# EAGLE design CTRL (EAGLE 7.6.0)
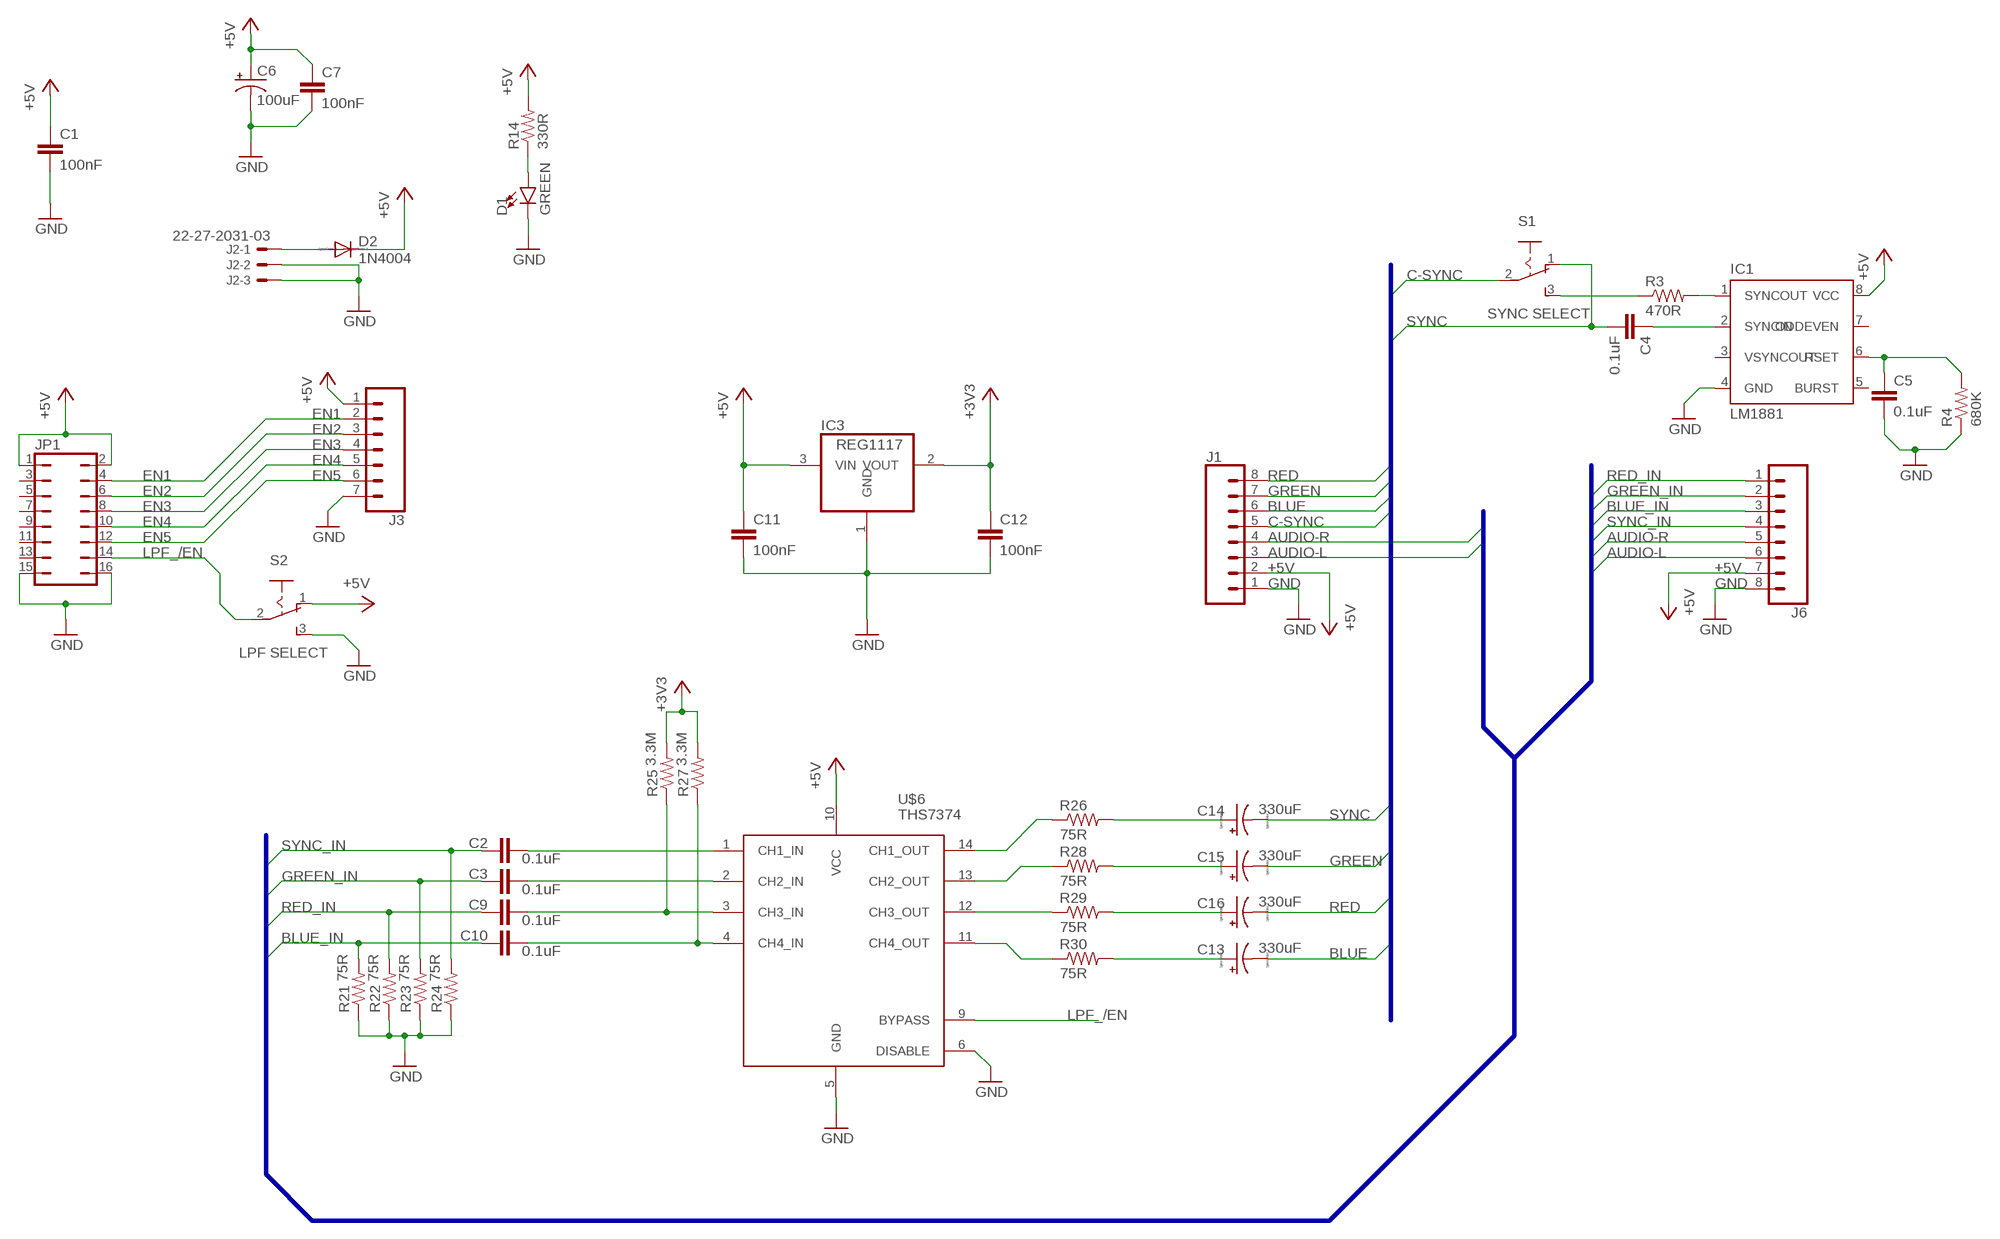
[diagram p0: schematic, sheet 1]

## Parts
C1  100nF  C-EU075-032X103  [C075-032X103]
C2  0.1uF  C-EU050-025X075  [C050-025X075]
C3  0.1uF  C-EU050-025X075  [C050-025X075]
C4  0.1uF  C7.5/3  [C7.5B3]
C5  0.1uF  C7.5/3  [C7.5B3]
C6  100uF  CPOL-USE2.5-7  [E2,5-7]
C7  100nF  C-EU075-032X103  [C075-032X103]
C9  0.1uF  C-EU050-025X075  [C050-025X075]
C10  0.1uF  C-EU050-025X075  [C050-025X075]
C11  100nF  C-EU075-032X103  [C075-032X103]
C12  100nF  C-EU075-032X103  [C075-032X103]
C13  330uF  CPOL-USD/7343-31W  [D/7343-31W]
C14  330uF  CPOL-USD/7343-31W  [D/7343-31W]
C15  330uF  CPOL-USD/7343-31W  [D/7343-31W]
C16  330uF  CPOL-USD/7343-31W  [D/7343-31W]
D1  GREEN  LED5MM  [LED_5MM]
D2  1N4004  [DO41-10]
IC1  LM1881  [DIL08]
IC3  REG1117  [SOT223]
J1  CONN_08LONGPADS  [1X08_LONGPADS]
J2  22-27-2031-03  [6410-03]
J3  CONN_07LONGPADS  [1X07_LONGPADS]
J6  CONN_08LONGPADS  [1X08_LONGPADS]
JP1  JP8Q  [JP8Q]
R3  470R  R-US_0204/7  [0204/7]
R4  680K  R-US_0204/7  [0204/7]
R14  330R  R-US_0204/7  [0204/7]
R21  75R  R-US_0204/2V  [0204V]
R22  75R  R-US_0204/2V  [0204V]
R23  75R  R-US_0204/2V  [0204V]
R24  75R  R-US_0204/2V  [0204V]
R25  3.3M  R-US_0204/7  [0204/7]
R26  75R  R-US_0204/7  [0204/7]
R27  3.3M  R-US_0204/7  [0204/7]
R28  75R  R-US_0204/7  [0204/7]
R29  75R  R-US_0204/7  [0204/7]
R30  75R  R-US_0204/7  [0204/7]
S1  SYNC SELECT  255SB  [255SB]
S2  LPF SELECT  255SB  [255SB]
U$6  THS7374  [TSSOP-14]

## Nets
+3V3: C12.1 IC3.2(VOUT) R25.2 R27.2
+5V: C1.1 C6.+ C7.1 C11.1 D2.C IC1.8(VCC) IC3.3(VIN) J1.2 J3.1 J6.7 JP1.1 JP1.2 R14.2 S2.1(O) U$6.10(VCC)
AUDIO-L: J1.3 J6.6
AUDIO-R: J1.4 J6.5
BLUE: C13.- J1.6
BLUE_IN: C10.1 J6.3 R21.2
C-SYNC [AMP]: J1.5 S1.2(P)
EN1: J3.2 JP1.4
EN2: J3.3 JP1.6
EN3: J3.4 JP1.8
EN4: J3.5 JP1.10
EN5: J3.6 JP1.12
GND: C1.2 C5.2 C6.- C7.2 C11.2 C12.2 D1.K(C) IC1.4(GND) IC3.1(GND) J1.1 J2.2 J2.3 J3.7 J6.8 JP1.15 JP1.16 R4.1 R21.1 R22.1 R23.1 R24.1 S2.3(S) U$6.5(GND) U$6.6(DISABLE)
GREEN: C15.- J1.7
GREEN_IN: C3.1 J6.2 R23.2
LPF_/EN: JP1.14 S2.2(P) U$6.9(BYPASS)
N$5 [AMP]: R3.1 S1.3(S)
N$6 [AMP]: IC1.1(SYNCOUT) R3.2
N$7 [AMP]: C4.1 IC1.2(SYNCIN)
N$8 [AMP]: C5.1 IC1.6(RSET) R4.2
N$16: D1.A R14.1
N$17: D2.A J2.1
N$18 [AMP]: C3.2 U$6.2(CH2_IN)
N$19 [AMP]: C9.2 R25.1 U$6.3(CH3_IN)
N$20 [AMP]: C10.2 R27.1 U$6.4(CH4_IN)
N$21 [AMP]: C2.2 U$6.1(CH1_IN)
N$22 [AMP]: R26.1 U$6.14(CH1_OUT)
N$23 [AMP]: R28.1 U$6.13(CH2_OUT)
N$24 [AMP]: R29.1 U$6.12(CH3_OUT)
N$25 [AMP]: R30.1 U$6.11(CH4_OUT)
N$26: C13.+ R30.2
N$27: C16.+ R29.2
N$28: C15.+ R28.2
N$29: C14.+ R26.2
RED: C16.- J1.8
RED_IN: C9.1 J6.1 R22.2
SYNC [AMP]: C4.2 C14.- S1.1(O)
SYNC_IN: C2.1 J6.4 R24.2
Unconnected: IC1.3(VSYNCOUT) IC1.5(BURST) IC1.7(ODDEVEN) JP1.3 JP1.5 JP1.7 JP1.9 JP1.11 JP1.13

## Buses
B$1
B$2

## Library data of the parts
C1-C3 C7 C9-C12 = rcl:C-EU: CAPACITOR, European symbol
C4 C5 = capacitor-wima:C: CAPACITOR naming: grid - package width
C6 = rcl:CPOL-US: POLARIZED CAPACITOR, American symbol
C13-C16 = resistor:CPOL-US: POLARIZED CAPACITOR, American symbol
D1 = SparkFun-LED:LED: LED (Generic) Standard schematic elements and footprints for 5mm, 3mm, 1206, and 0603 sized LEDs. Generic LEDs with no color specified.
D2 = diode:1N4004: DIODE general purpose rectifier, 1 A
IC1 = lm1881:LM1881
IC3 = burr-brown:REG1117: 800mA and 1A Low Dropout (LDO) Positive Regulator 1.8V, 2.5V, 2.85V, 3.3V, 5V, and Adj; MPN: REG1117; OC_FARNELL: 1097566; OC_NEWARK: 14P6981
J1 J6 = SparkFun-Connectors:CONN_08: Multi connection point. Often used as Generic Header-pin footprint for 0.1 inch spaced/style header connections On any of the 0.1 inch spaced packages, you can populate with these: Break Away Headers - Straight <https://www.sparkfun.com/products/116> (PRT-00116) Break Away Male Headers - Right Angle <https://www.sparkfun.com/products/553> (PRT-00553) Female Headers <https://www.sparkfun.com/products/115> (PRT-00115) Break Away Headers - Machine Pin <https://www.sparkfun.com/products/117> (PRT-00117) Break Away Female Headers - Swiss Machine Pin <https://www.sparkfun.com/products/743> (PRT-00743) Arduino Stackable Header - 8 Pin <https://www.sparkfun.com/products/9279> (PRT-09279) For SCREWTERMINALS and SPRING TERMINALS visit here: Screw Terimnals on SparkFun.com <https://www.sparkfun.com/search/results?term=Screw+Terminals> (5mm/3.5mm/2.54mm spacing) This device is also useful as a general connection point to wire up your design to another part of your project. Our various solder wires solder well into these plated through hole pads. Hook-Up Wire - Assortment (Stranded, 22 AWG) <https://www.sparkfun.com/products/11375> (PRT-11375) Hook-Up Wire - Assortment (Solid Core, 22 AWG) <https://www.sparkfun.com/products/11367> (PRT-11367) View the entire wire category on our website here <https://www.sparkfun.com/categories/141> Special notes: Molex polarized connector foot print use with SKU : PRT-08231 with associated crimp pins and housings. 1MM SMD Version SKU: PRT-10208 NOTES ON THE VARIANTS LOCK and LOCK_LONGPADS... This footprint was designed to help hold the alignment of a through-hole component (i.e. 6-pin header) while soldering it into place. You may notice that each hole has been shifted either up or down by 0.005 of an inch from it's more standard position (which is a perfectly straight line). This slight alteration caused the pins (the squares in the middle) to touch the edges of the holes. Because they are alternating, it causes a "brace" to hold the component in place. 0.005 has proven to be the perfect amount of "off-center" position when using our standard breakaway headers. Although looks a little odd when you look at the bare footprint, once you have a header in there, the alteration is very hard to notice. Also,if you push a header all the way into place, it is covered up entirely on the bottom side.
J2 = con-molex:22-?-03: CONNECTOR wire to board 2.54 mm (.1 inch) pitch header; OC_FARNELL: unknown; OC_NEWARK: unknown
J3 = SparkFun-Connectors:CONN_07: Multi connection point. Often used as Generic Header-pin footprint for 0.1 inch spaced/style header connections On any of the 0.1 inch spaced packages, you can populate with these: Break Away Headers - Straight <https://www.sparkfun.com/products/116> (PRT-00116) Break Away Male Headers - Right Angle <https://www.sparkfun.com/products/553> (PRT-00553) Female Headers <https://www.sparkfun.com/products/115> (PRT-00115) Break Away Headers - Machine Pin <https://www.sparkfun.com/products/117> (PRT-00117) Break Away Female Headers - Swiss Machine Pin <https://www.sparkfun.com/products/743> (PRT-00743) For SCREWTERMINALS and SPRING TERMINALS visit here: Screw Terimnals on SparkFun.com <https://www.sparkfun.com/search/results?term=Screw+Terminals> (5mm/3.5mm/2.54mm spacing) This device is also useful as a general connection point to wire up your design to another part of your project. Our various solder wires solder well into these plated through hole pads. Hook-Up Wire - Assortment (Stranded, 22 AWG) <https://www.sparkfun.com/products/11375> (PRT-11375) Hook-Up Wire - Assortment (Solid Core, 22 AWG) <https://www.sparkfun.com/products/11367> (PRT-11367) View the entire wire category on our website here <https://www.sparkfun.com/categories/141> Special notes: Molex polarized connector foot print use with SKU : PRT-08231 with associated crimp pins and housings. 1MM SMD Version SKU: PRT-10208 NOTES ON THE VARIANTS LOCK and LOCK_LONGPADS... This footprint was designed to help hold the alignment of a through-hole component (i.e. 6-pin header) while soldering it into place. You may notice that each hole has been shifted either up or down by 0.005 of an inch from it's more standard position (which is a perfectly straight line). This slight alteration caused the pins (the squares in the middle) to touch the edges of the holes. Because they are alternating, it causes a "brace" to hold the component in place. 0.005 has proven to be the perfect amount of "off-center" position when using our standard breakaway headers. Although looks a little odd when you look at the bare footprint, once you have a header in there, the alteration is very hard to notice. Also,if you push a header all the way into place, it is covered up entirely on the bottom side.
JP1 = jumper:JP8Q: JUMPER
R3 R4 R21-R30 = rcl:R-US_: RESISTOR, American symbol
R14 = resistor:R-US_: RESISTOR, American symbol
S1 S2 = switch:255SB: SLIDING SWITCH Distributor Buerklin, 11G810
U$6 = THS7374:THS7374

## Net classes
0 default: width 0.406 mm
1 AMP: width 0.381 mm

## Board
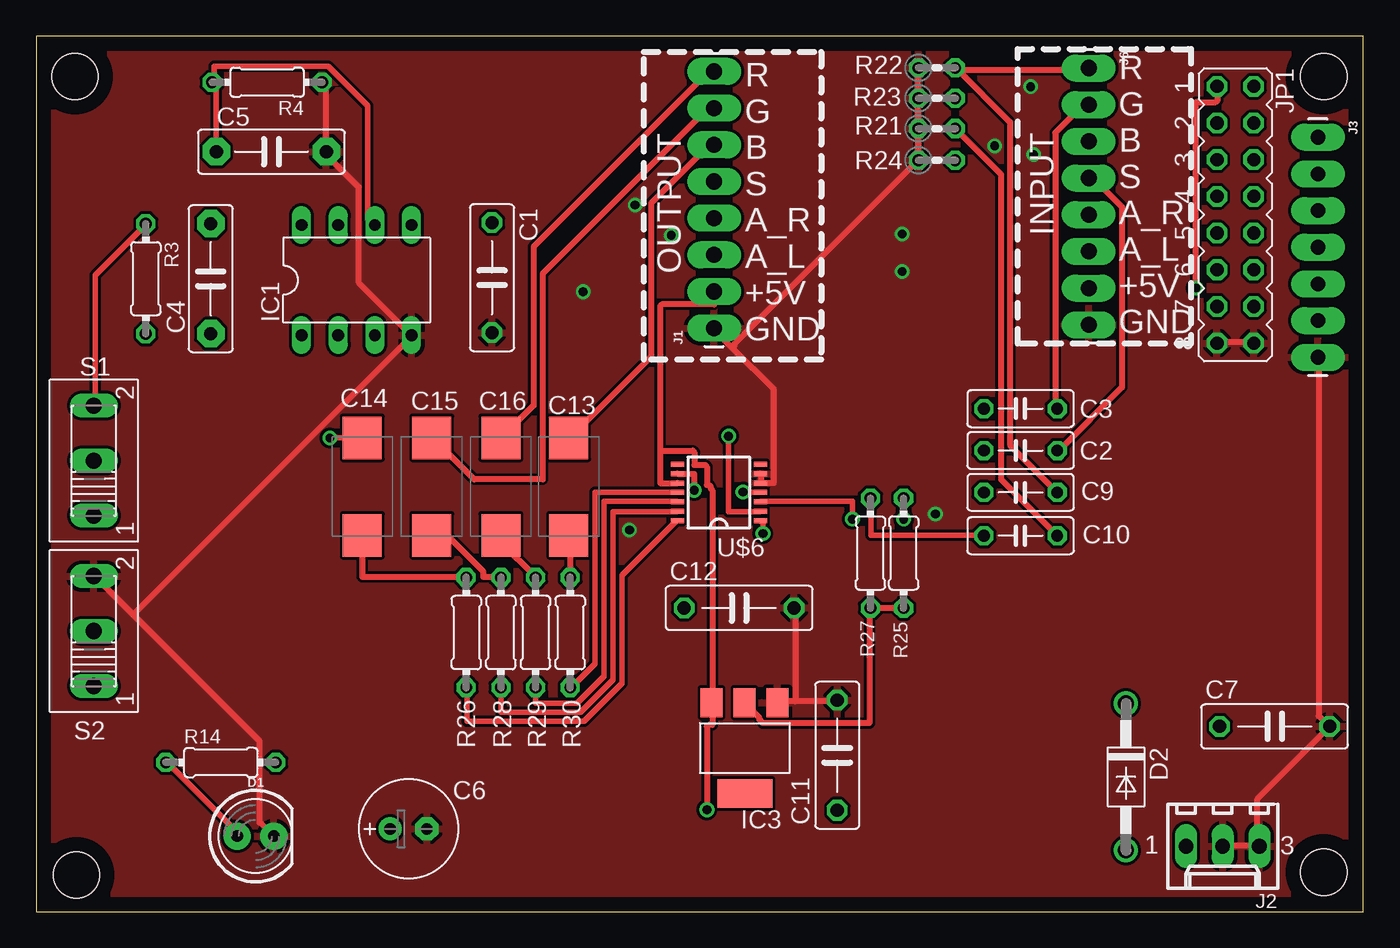
[diagram p1: board, top side]
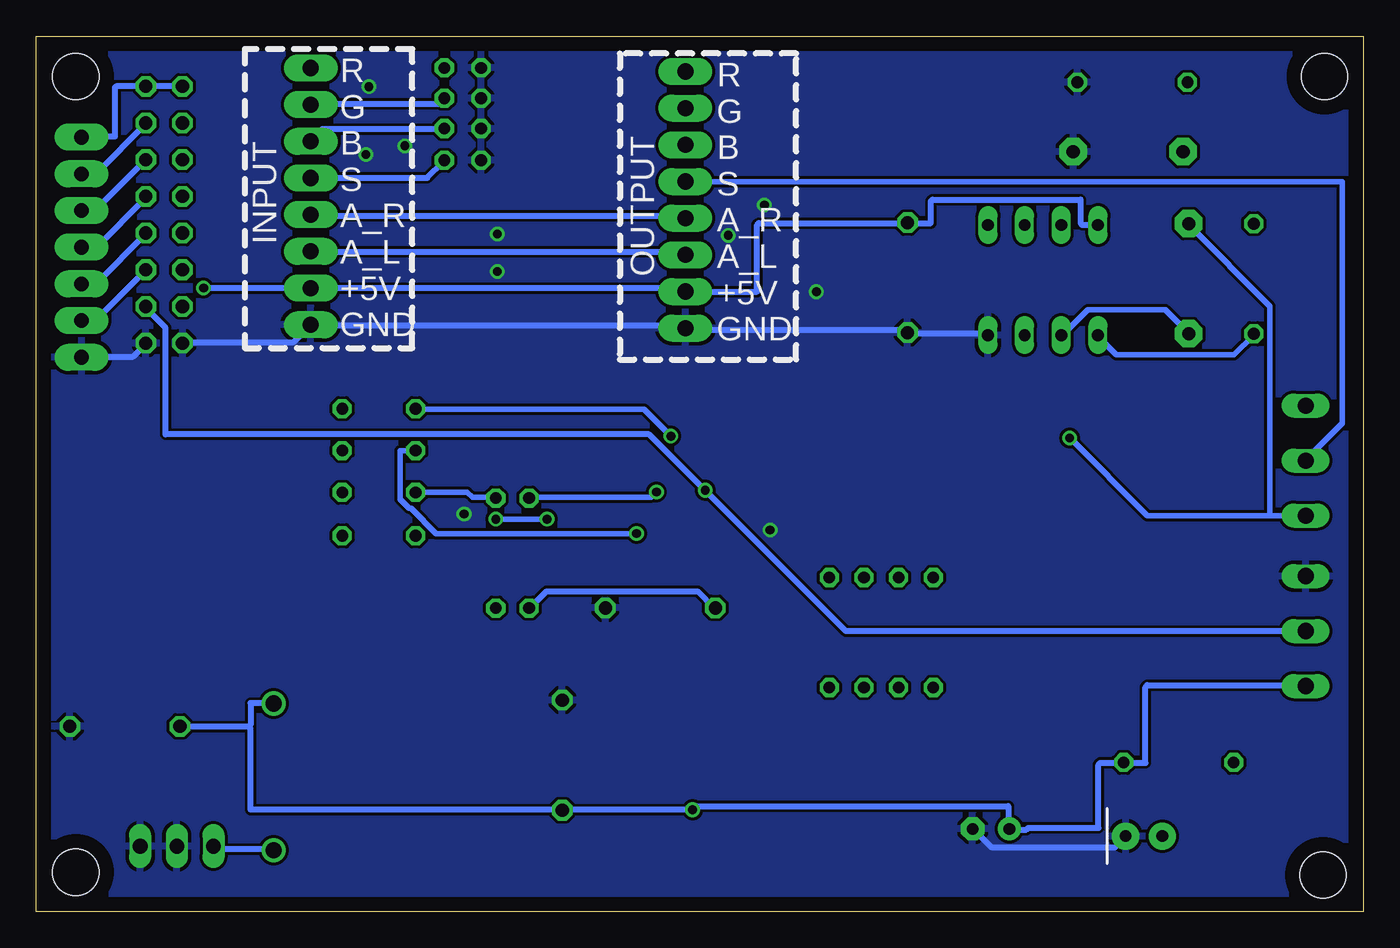
[diagram p2: board, bottom side, seen from below]

Size 91.95 x 60.63 mm. Coordinates in mm from the lower left corner, seen from the top.
Outline: 0,0 91.95,0 91.95,60.63 0,60.63 0,0
Copper layers (1*16): Top 0.035mm / dielectric 1.5mm / Bottom 0.035mm
Design rules "default": minimum track width 10mil, minimum drill 24mil, track to track 8mil, track to pad 8mil, pad to pad 8mil, via to via 8mil, smd to smd 8mil, copper to edge 40mil, drill to drill 8mil, minimum pad ring 10mil, minimum via ring 8mil, stop-mask expansion 4mil, vias tented up to drill 0mil, thermal gap 10mil
Holes 3.2 mm at 2.7,57.83 2.8,2.53 89.2,2.73 89.2,57.83

### Footprints (pad centres in the part's own frame; a part is rotated, then mirrored left to right if it is on the bottom)
C075-032X103 = drill 0.914 octagon: 1 -3.81,0; 2 3.81,0
C050-025X075 = drill 0.813 octagon: 1 -2.54,0; 2 2.54,0
C7.5B3 = drill 0.914 pad 1.905 octagon: 1 -3.81,0; 2 3.81,0
E2,5-7 = drill 0.813 pad 1.6: + -1.27,0 | drill 0.813 pad 1.6 octagon: - 1.27,0
D/7343-31W = smd 2.95 x 2.7: + 3.375,0; - -3.375,0
LED_5MM = drill 0.813 pad 1.88: A -1.27,0; K 1.27,0
DO41-10 = drill 1.118: A 5.08,0; C -5.08,0
DIL08 = drill 0.813 long: 1 -3.81,-3.81; 2 -1.27,-3.81; 3 1.27,-3.81; 4 3.81,-3.81; 5 3.81,3.81; 6 1.27,3.81; 7 -1.27,3.81; 8 -3.81,3.81
SOT223 = smd 1.499 x 2.007: 1 -2.261,-3.15; 2 0.025,-3.15; 3 2.311,-3.15 | smd 3.81 x 2.007: 4 0,3.15
1X08_LONGPADS = drill 1.118 pad 1.88 long: 1 0,0; 2 2.54,0; 3 5.08,0; 4 7.62,0; 5 10.16,0; 6 12.7,0; 7 15.24,0; 8 17.78,0
6410-03 = drill 1.016 long: 1 2.54,0; 2 0,0; 3 -2.54,0
1X07_LONGPADS = drill 1.016 pad 1.88 long: 1 0,0; 2 2.54,0; 3 5.08,0; 4 7.62,0; 5 10.16,0; 6 12.7,0; 7 15.24,0
JP8Q = drill 0.914 octagon: 1 -8.89,-1.27; 2 -8.89,1.27; 3 -6.35,-1.27; 4 -6.35,1.27; 5 -3.81,-1.27; 6 -3.81,1.27; 7 -1.27,-1.27; 8 -1.27,1.27; 9 1.27,-1.27; 10 1.27,1.27; 11 3.81,-1.27; 12 3.81,1.27; 13 6.35,-1.27; 14 6.35,1.27; 15 8.89,-1.27; 16 8.89,1.27
0204/7 = drill 0.813 octagon: 1 -3.81,0; 2 3.81,0
0204V = drill 0.813 octagon: 1 -1.27,0; 2 1.27,0
255SB = drill 1.118 long: 1 -3.81,0; 2 0,0; 3 3.81,0
TSSOP-14 = smd 0.9 x 0.35: 1 -2.875,1.95; 2 -2.875,1.3; 3 -2.875,0.65; 4 -2.875,0; 5 -2.875,-0.65; 6 -2.875,-1.3; 7 -2.875,-1.95; 8 2.875,-1.95; 9 2.875,-1.3; 10 2.875,-0.65; 11 2.875,0; 12 2.875,0.65; 13 2.875,1.3; 14 2.875,1.95

### Placement (x,y rotation side)
C1  31.58,43.9 270 top
C2  68.2,31.93 180 top
C3  68.2,34.83 180 top
C4  12.1,43.83 90 top
C5  16.3,52.63 0 top
C6  25.8,5.73 0 top
C7  85.8,12.83 0 top
C9  68.2,29.03 180 top
C10  68.2,26.03 180 top
C11  55.5,10.83 90 top
C12  48.7,21.03 0 top
C13  36.9,29.43 270 top
C14  22.6,29.43 270 top
C15  27.4,29.43 270 top
C16  32.2,29.43 270 top
D1  15.2,5.23 0 top
D2  75.5,9.33 270 top
IC1  22.2,43.73 0 top
IC3  49.1,11.33 180 top
J1  46.97,40.4 90 top
J2  82.2,4.53 180 top
J3  88.8,53.63 270 top
J6  72.92,58.42 270 top
JP1  83.08,48.26 270 top
R3  7.6,43.83 270 top
R4  16,57.43 180 top
R14  12.8,10.33 0 top
R21  62.4,54.23 0 top
R22  62.4,58.43 0 top
R23  62.4,56.33 0 top
R24  62.4,52.03 0 top
R25  60.1,24.83 270 top
R26  29.8,19.33 90 top
R27  57.8,24.83 270 top
R28  32.2,19.33 90 top
R29  34.6,19.33 90 top
R30  37,19.33 90 top
S1  4,31.23 90 top
S2  4,19.43 90 top
U$6  47.3,29.03 180 top

### Tracks (layer width: path | path; a pad name or v marks a point on that pad's centre or on a via)
+3V3
  Top 0.406: IC3.2 49.1,14.43 50.1,13.43 50.1,13.3 50.35,13.05 57.73,13.05 57.73,20.93 R27.2 57.98,21.05 60.1,21.05 R25.2
  Bottom 0.406: C12.1 44.98,21.05 46.1,22.18 56.6,22.18 57.73,21.05 R27.2
+5V  (via drill 0.61)
  Top 0.406: U$6.10 43.23,29.68 43.23,31.93 | 43.23,31.93 43.23,41.93 43.35,42.05 46.98,42.05 J1.2 | 43.23,31.93 45.48,31.93 45.6,31.8 45.6,30.93 46.35,30.93 46.48,30.8 46.48,29.55 46.6,29.55 46.73,29.43 46.73,29.3 46.85,29.18 46.85,14.55 IC3.3 46.85,14.3 46.85,12.93 46.6,12.93 46.48,12.8 v46.48,7.05 | v80.35,43.18 80.35,56.05 81.72,56.05 81.85,56.18 81.85,57.05 JP1.1
  Bottom 0.406: S2.1 4.1,15.68 14.97,15.68 15.1,15.55 15.1,10.3 16.48,10.3 R14.2 16.73,10.3 18.23,10.3 18.35,10.18 18.35,5.8 23.23,5.8 23.35,5.68 24.48,5.68 C6.+ 24.6,5.93 24.6,7.3 46.23,7.3 v46.48,7.05 55.48,7.05 C11.1 55.6,7.05 77.1,7.05 77.1,12.68 77.22,12.8 | IC1.8 18.48,47.55 19.48,47.55 19.6,47.68 19.6,49.3 29.85,49.3 29.98,49.18 29.98,47.68 31.48,47.68 C1.1 31.73,47.68 41.88,47.68 42,47.55 42,42.93 46.85,42.93 J1.2 48.48,42.93 48.48,43.05 48.6,43.18 J6.7 v80.35,43.18 | JP1.1 81.85,57.18 84.35,57.18 JP1.2 84.47,57.18 86.35,57.18 86.47,57.05 86.47,53.68 88.72,53.68 J3.1 | 77.22,12.8 81.97,12.8 C7.1 | 77.22,12.8 77.1,12.93 77.1,14.43 75.6,14.43 D2.C
AUDIO-L
  Bottom 0.406: J1.3 46.98,45.55 47.1,45.68 72.85,45.68 J6.6
AUDIO-R
  Bottom 0.406: J1.4 46.98,48.05 47.1,48.18 72.85,48.18 J6.5
BLUE
  Top 0.406: C13.- 36.98,32.8 42.6,38.43 42.6,49.05 46.6,53.05 46.85,53.05 J1.6
BLUE_IN
  Top 0.406: C10.1 70.72,26.05 66.85,29.93 66.85,51.05 63.73,54.18 R21.2
  Bottom 0.406: J6.3 72.85,53.43 72.1,54.18 63.73,54.18 R21.2
C-SYNC
  Bottom 0.381: S1.2 3.98,31.3 1.48,33.8 1.48,50.55 46.85,50.55 J1.5
EN1
  Bottom 0.406: JP1.4 84.35,54.55 87.72,51.18 88.72,51.18 J3.2
EN2
  Bottom 0.406: JP1.6 84.35,52.05 87.85,48.55 88.72,48.55 J3.3
EN3
  Bottom 0.406: JP1.8 84.35,49.43 87.72,46.05 88.72,46.05 J3.4
EN4
  Bottom 0.406: JP1.10 84.35,46.93 87.72,43.55 88.72,43.55 J3.5
EN5
  Bottom 0.406: J3.6 87.85,40.93 84.35,44.43 JP1.12
GND  (via drill 0.61)
  Top 0.406: J2.2 82.47,4.55 84.35,4.55 J2.3 84.6,4.8 84.6,7.8 89.6,12.8 C7.2 89.47,12.93 88.85,13.55 88.85,38.3 J3.7 | JP1.15 81.85,39.43 84.35,39.43 JP1.16 | 6.72,20.55 15.47,11.8 15.47,6.18 16.35,5.3 D1.K | 6.72,20.55 4.1,23.18 S2.3 | R4.1 19.85,57.43 20.1,57.18 20.1,52.68 C5.2 20.1,52.43 22.35,50.18 22.35,43.55 25.98,39.93 IC1.4 25.85,39.8 25.85,39.68 6.72,20.55 | R22.1 61.1,58.43 61.1,56.43 R23.1 61.1,56.3 61.1,54.43 R21.1 61.1,54.18 61.1,52.05 R24.1 60.98,51.93 48.35,39.3 48.35,39.18 48.23,39.05 | 52.6,14.55 55.48,14.55 C11.2 | 52.6,14.55 51.48,14.55 IC3.1 | U$6.6 50.23,30.3 50.23,29.68 U$6.5 51.1,29.68 51.1,36.18 48.23,39.05 | 52.48,21.05 C12.2 52.6,20.93 52.6,14.55 | 48.23,39.05 46.98,40.3 J1.1
  Top 0.5: 82.32,4.58 J2.2 | 84.6,4.58 J2.3
  Bottom 0.406: JP1.16 84.35,39.3 85.22,38.43 88.72,38.43 J3.7 | JP1.15 81.72,39.43 74.1,39.43 72.97,40.55 J6.8 72.72,40.68 72.6,40.55 47.1,40.55 J1.1 46.85,40.3 31.85,40.3 31.73,40.18 C1.2 31.48,40.05 26.23,40.05 26.1,39.93 IC1.4 | C6.- 26.98,5.68 25.73,4.43 17.23,4.43 16.48,5.18 D1.K
  other vias: 62.3,27.53 60,46.93 60,44.33 37.9,42.93 41.5,48.93 41.1,26.43 44,46.83 69.1,52.43 68.9,57.13 66.4,53.03
  pour Bottom: 0,60.63 92,60.63 92,0.03 0,0.03
  pour Top: 0,60.63 92,60.63 92,0.03 0,0.03
GREEN
  Top 0.406: C15.- 27.48,32.8 30.35,29.93 35.1,29.93 35.1,44.18 46.48,55.55 46.85,55.55 J1.7
GREEN_IN
  Top 0.406: C3.1 70.72,34.93 70.6,35.05 70.6,53.93 72.47,55.8 72.85,55.8 J6.2
  Bottom 0.406: R23.2 63.73,56.3 64.1,55.93 72.85,55.93 J6.2
LPF_/EN  (via drill 0.61)
  Top 0.406: v45.6,29.18 45.6,30.3 44.48,30.3 U$6.9
  Bottom 0.406: S2.2 35.85,19.43 v45.6,29.18 49.48,33.05 82.97,33.05 82.97,40.43 84.35,41.8 JP1.14
N$5
  Top 0.381: R3.1 7.6,47.55 4.1,44.05 4.1,35.05 S1.3
N$6
  Bottom 0.381: R3.2 7.6,39.93 8.97,38.55 17.1,38.55 18.35,39.8 IC1.1
N$7
  Bottom 0.381: IC1.2 20.85,39.93 19.1,41.68 13.72,41.68 12.1,40.05 C4.1
N$8
  Top 0.381: C5.1 12.47,52.68 12.47,57.18 12.22,57.43 R4.2 12.35,57.55 12.35,58.55 20.23,58.55 22.98,55.8 22.98,47.93 23.35,47.55 IC1.6
N$16
  Top 0.406: R14.1 9.1,10.3 13.85,5.55 13.85,5.3 D1.A
N$17
  Bottom 0.406: J2.1 79.6,4.43 79.47,4.3 75.6,4.3 D2.A
N$18  (via drill 0.61)
  Top 0.381: v47.98,32.93 47.98,27.68 50.1,27.68 U$6.2
  Bottom 0.381: v47.98,32.93 49.85,34.8 65.6,34.8 C3.2
N$19  (via drill 0.61)
  Top 0.381: v56.55,27.18 56.55,28.43 50.23,28.43 U$6.3 | R25.1 v60.1,27.18
  Bottom 0.381: v60.1,27.18 v56.55,27.18 | C9.2 65.6,29.05 62.1,29.05 61.73,28.68 60.1,28.68 R25.1
N$20  (via drill 0.61)
  Top 0.381: v48.98,29.05 50.1,29.05 U$6.4 | C10.2 65.6,26.05 57.85,26.05 57.85,28.55 R27.1
  Bottom 0.381: v48.98,29.05 49.35,28.68 57.73,28.68 R27.1
N$21  (via drill 0.61)
  Top 0.381: v50.35,26.18 50.35,26.93 50.23,27.05 U$6.1
  Bottom 0.381: v50.35,26.18 64.22,26.18 65.97,27.93 66.1,27.93 66.72,28.55 66.72,31.93 C2.2
N$22
  Top 0.381: U$6.14 44.35,27.05 40.6,23.3 40.6,15.8 37.98,13.18 29.85,13.18 29.85,15.43 R26.1
N$23
  Top 0.381: U$6.13 44.35,27.68 39.98,27.68 39.98,16.05 37.73,13.8 32.23,13.8 32.23,15.43 R28.1
N$24
  Top 0.381: R29.1 34.6,14.43 37.48,14.43 39.35,16.3 39.35,28.43 44.35,28.43 U$6.12
N$25
  Top 0.381: U$6.11 44.35,29.05 38.73,29.05 38.73,17.18 37.1,15.55 R30.1
N$26
  Top 0.406: R30.2 36.98,23.18 36.98,26.05 C13.+
N$27
  Top 0.406: R29.2 34.6,23.18 32.23,25.55 32.23,26.05 C16.+
N$28
  Top 0.406: C15.+ 28.48,26.05 30.98,23.55 30.98,23.18 32.1,23.18 R28.2
N$29
  Top 0.406: C14.+ 22.6,23.18 29.73,23.18 R26.2
RED
  Top 0.406: J1.8 46.6,58.18 34.48,46.05 34.48,35.05 32.23,32.8 C16.-
RED_IN
  Top 0.406: C9.1 70.72,29.05 67.47,32.3 67.47,54.68 63.73,58.43 R22.2 64.1,58.3 72.85,58.3 J6.1
SYNC  (via drill 0.61)
  Top 0.381: v20.35,32.8 C14.-
  Bottom 0.381: v20.35,32.8 14.97,27.43 6.47,27.43 | 6.47,27.43 4.1,27.43 S1.1 | 6.47,27.43 6.47,41.93 12.1,47.55 C4.2
SYNC_IN
  Top 0.406: C2.1 70.85,31.93 75.22,36.3 75.22,48.8 73.35,50.68 72.97,50.68 J6.4
  Bottom 0.406: R24.2 63.73,51.93 64.85,50.8 72.85,50.8 J6.4

### Text on the board
tPlace: OUTPUT | INPUT | R / G / B / S / A_R / A_L / +5V / GND | R / G / B / S / A_R / A_L / +5V / GND
bPlace: OUTPUT | INPUT | R / G / B / S / A_R / A_L / +5V / GND | R / G / B / S / A_R / A_L / +5V / GND